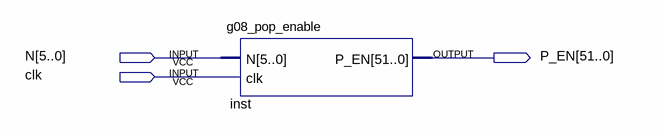
[diagram p0: schematic sheet]
// Quartus schematic g08_p_en.bdf as structural Verilog: 1 symbols, 3 pins
module g08_p_en (
  input  [5:0] N,
  input  clk,
  output [51:0] P_EN
);

  g08_pop_enable inst (.N(N), .clk(clk), .P_EN(P_EN));
endmodule
